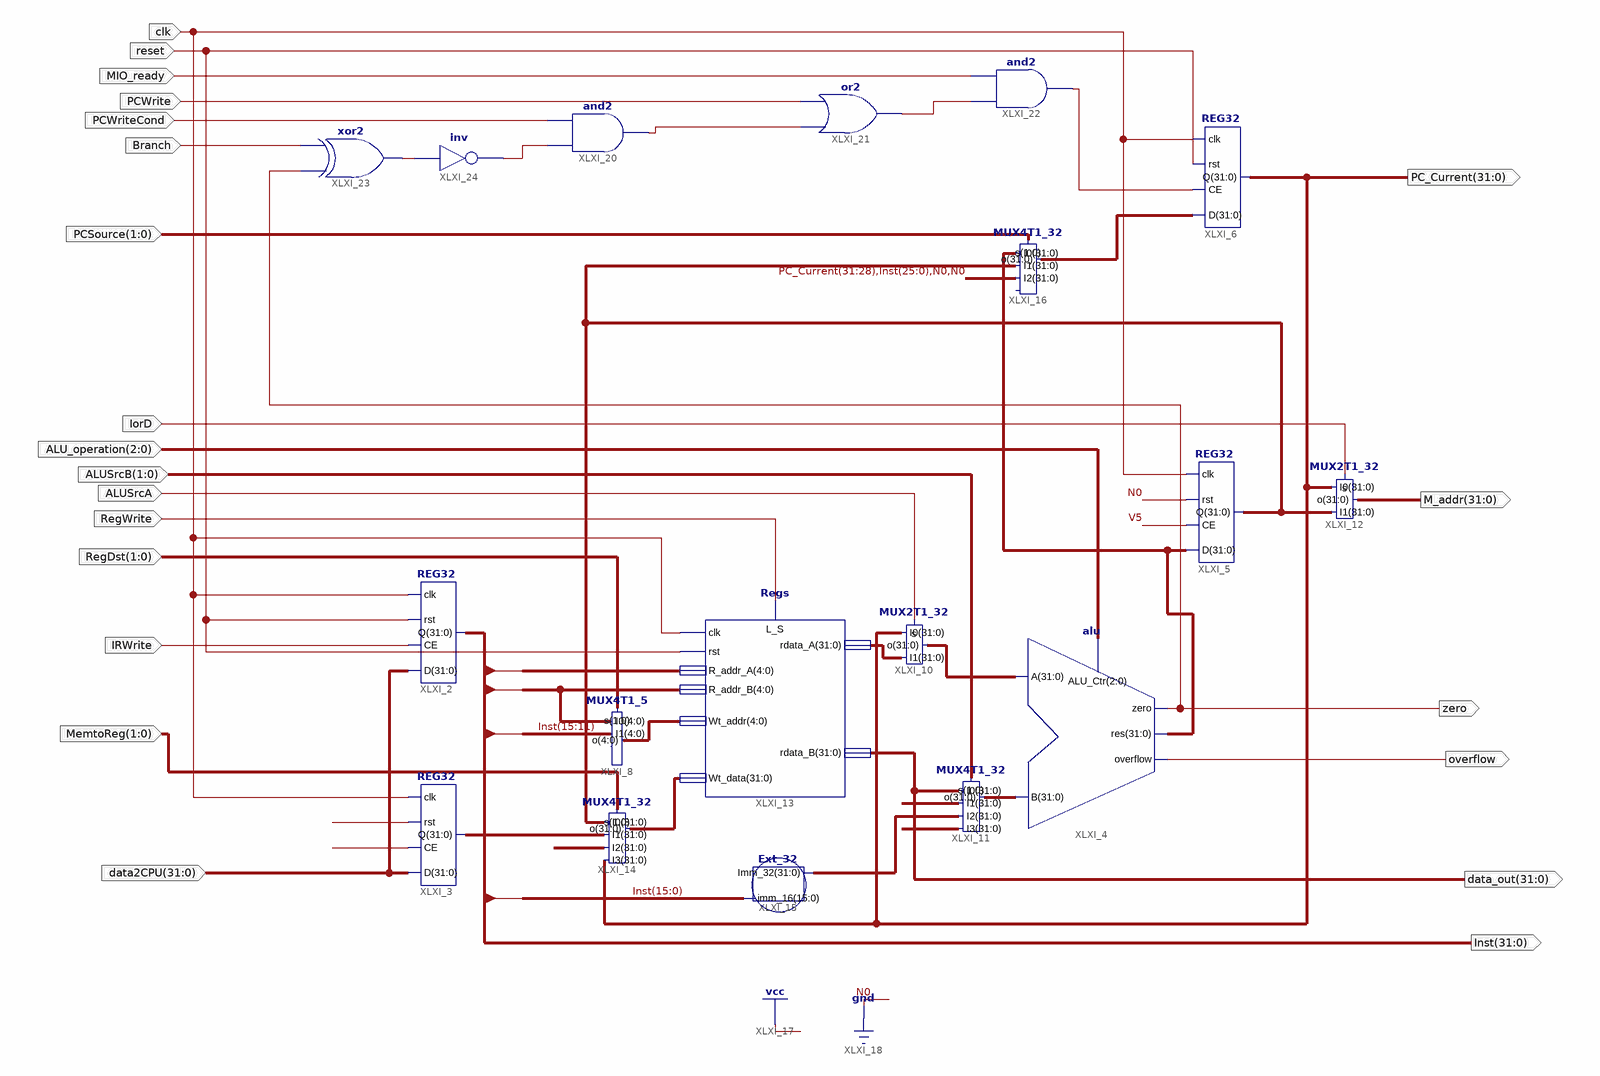
[diagram p0: schematic sheet 1]
// Xilinx ISE schematic M_datapath.sch (kintex7) as structural Verilog: 18 symbols, 22 ports
module M_datapath (
  input  IorD,
  input  [2:0] ALU_operation,
  input  [1:0] ALUSrcB,
  input  ALUSrcA,
  input  clk,
  input  RegWrite,
  input  [1:0] RegDst,
  input  IRWrite,
  input  [1:0] MemtoReg,
  input  [31:0] data2CPU,
  input  reset,
  input  [1:0] PCSource,
  input  MIO_ready,
  input  PCWrite,
  input  PCWriteCond,
  input  Branch,
  output [31:0] Inst,
  output [31:0] data_out,
  output [31:0] PC_Current,
  output overflow,
  output zero,
  output [31:0] M_addr
);

  wire XLXN_89, XLXN_95, XLXN_98, XLXN_106, XLXN_107;
  wire [4:0] XLXN_38;
  wire [31:0] ALU_Out, imm_32, XLXN_39, XLXN_40, XLXN_43, XLXN_44, XLXN_46, XLXN_69, XLXN_101;

  REG32 XLXI_2 (.D(data2CPU), .CE(IRWrite), .rst(reset), .clk(clk), .Q(Inst));
  REG32 XLXI_3 (.D(data2CPU), .CE(1'b1), .rst(1'b0), .clk(clk), .Q(XLXN_40));
  alu XLXI_4 (.ALU_Ctr(ALU_operation), .res(XLXN_101), .zero(zero), .overflow(overflow), .A(XLXN_44), .B(XLXN_46));
  REG32 XLXI_5 (.D(XLXN_101), .CE(1'b1), .rst(1'b0), .clk(clk), .Q(ALU_Out));
  REG32 XLXI_6 (.D(XLXN_69), .CE(XLXN_98), .rst(reset), .clk(clk), .Q(PC_Current));
  MUX4T1_5 XLXI_8 (.s(RegDst), .I1(Inst[15:11]), .I0(Inst[20:16]), .o(XLXN_38));  // open: I2, I3
  MUX2T1_32 XLXI_10 (.s(ALUSrcA), .I0(PC_Current), .I1(XLXN_43), .o(XLXN_44));
  MUX4T1_32 XLXI_11 (
    .s(ALUSrcB), .I0(data_out), .I1(32'b00000000000000000000000000000100), .I2(imm_32),
    .I3({{15{Inst[15]}}, Inst[14:0], 2'b00}), .o(XLXN_46));
  MUX2T1_32 XLXI_12 (.s(IorD), .I0(PC_Current), .I1(ALU_Out), .o(M_addr));
  Regs XLXI_13 (
    .clk(clk), .L_S(RegWrite), .rdata_A(XLXN_43), .rst(reset), .Wt_data(XLXN_39), .rdata_B(data_out),
    .R_addr_A(Inst[25:21]), .R_addr_B(Inst[20:16]), .Wt_addr(XLXN_38));
  MUX4T1_32 XLXI_14 (
    .s(MemtoReg), .I0(ALU_Out), .I1(XLXN_40), .I2({Inst[15:0], {16{1'b0}}}), .I3(PC_Current), .o(XLXN_39));
  Ext_32 XLXI_15 (.imm_16(Inst[15:0]), .Imm_32(imm_32));
  MUX4T1_32 XLXI_16 (
    .s(PCSource), .I0(XLXN_101), .I1(ALU_Out), .I2({PC_Current[31:28], Inst[25:0], 2'b00}), .o(XLXN_69));  // open: I3
  and XLXI_20 (XLXN_89, XLXN_107, PCWriteCond);
  or XLXI_21 (XLXN_95, XLXN_89, PCWrite);
  and XLXI_22 (XLXN_98, XLXN_95, MIO_ready);
  xor XLXI_23 (XLXN_106, zero, Branch);
  not XLXI_24 (XLXN_107, XLXN_106);
endmodule
